# EAGLE design tian_light_mega_revc (EAGLE 6.1)
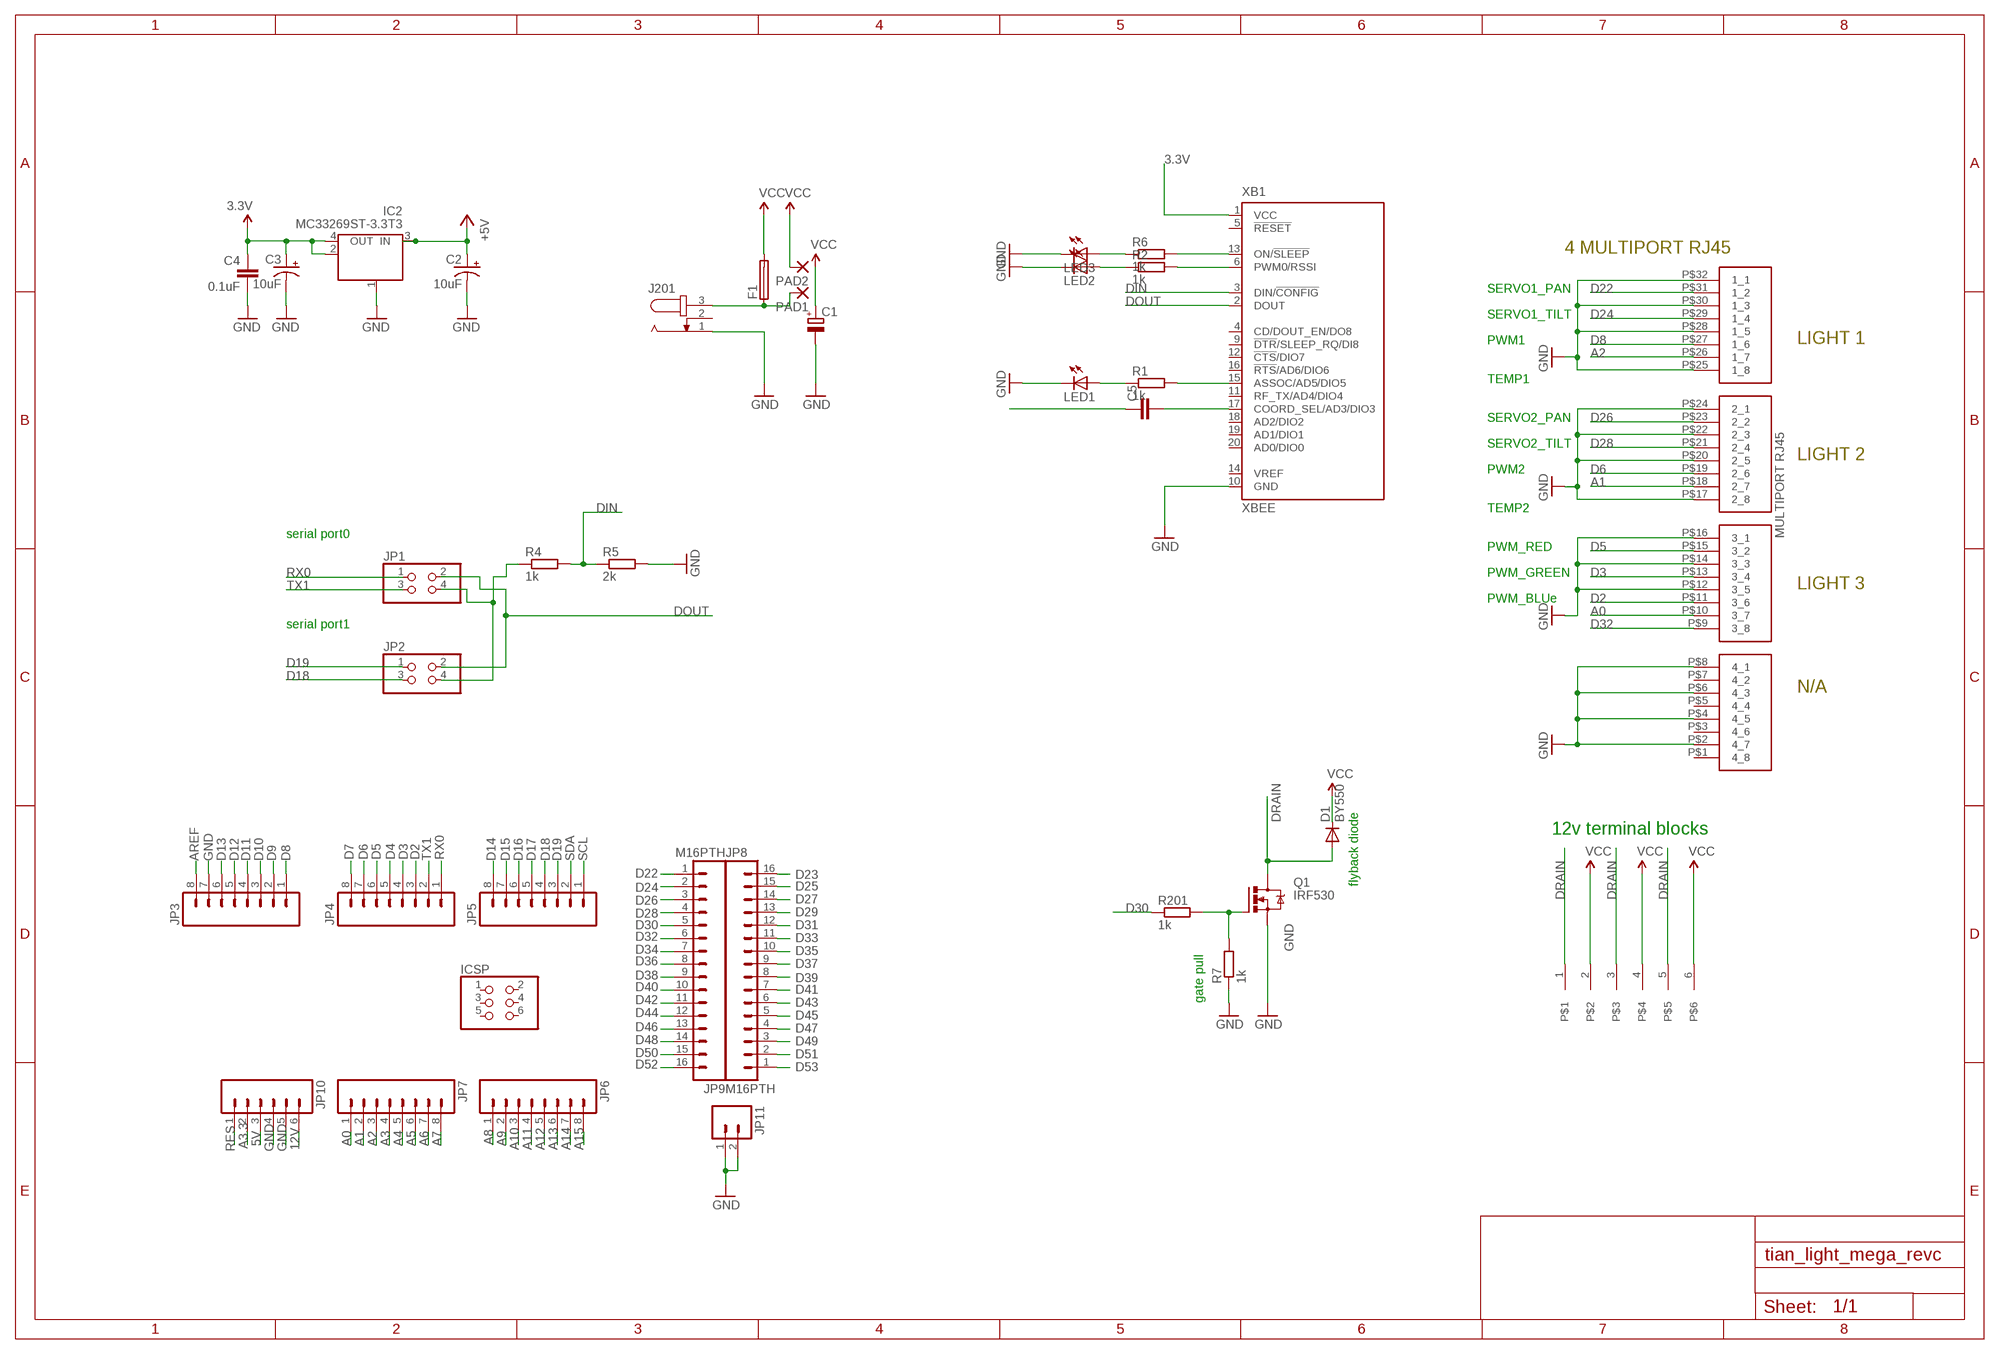
[diagram p0: schematic, sheet 1]

## Parts
C1  CPOL-EU153CLV-0605  [153CLV-0605]
C2  10uF  CAP_POL1206  [EIA3216]
C3  10uF  CAP_POL1206  [EIA3216]
C4  0.1uF  CAP0603-CAP  [0603-CAP]
C5  C-EUC0805  [C0805]
D1  BY550  [DO27-15]
F1  SH22,5  [SH22,5]
IC2  MC33269ST-3.3T3  [SOT223]
ICSP  PINHD-2X3  [2X03]
J201  JACK-PLUG0  [SPC4077]
JP1  PINHD-2X2  [2X02]
JP2  PINHD-2X2  [2X02]
JP3  M08LONGPADS  [1X08_LONGPADS]
JP4  M08LONGPADS  [1X08_LONGPADS]
JP5  M08LONGPADS  [1X08_LONGPADS]
JP6  M08LONGPADS  [1X08_LONGPADS]
JP7  M08LONGPADS  [1X08_LONGPADS]
JP8  M16PTH  [1X16]
JP9  M16PTH  [1X16]
JP10  M06SIP  [1X06]
JP11  M02LOCK  [1X02_LOCK]
LED1  LEDSML1206  [SML1206]
LED2  LEDSML1206  [SML1206]
LED3  LEDSML1206  [SML1206]
PAD1  2,15/1,0  [2,15/1,0]
PAD2  2,15/1,0  [2,15/1,0]
PORT201  4PORT_ETHERNET  [4PORT_ETHERNET]
Q1  IRF530  [TO220BV]
R1  1k  R-EU_M1206  [M1206]
R2  1k  R-EU_M1206  [M1206]
R4  1k  R-EU_M1206  [M1206]
R5  2k  R-EU_M1206  [M1206]
R6  1k  R-EU_M1206  [M1206]
R7  1k  R-EU_M1206  [M1206]
R201  1k  R-EU_M1206  [M1206]
U$3  MFKDSP6-5.08  [PHONEIX]
XB1  XBEE  [XBEE]

## Nets
3.3V: C3.A(+) C4.1 IC2.2(OUT) IC2.4(OUT) XB1.1(VCC)
5V: C2.A(+) IC2.3(IN) JP10.3 ; supply symbol labelled +5V
12V: C1.+ F1.2 JP10.6 PAD2.1(P) U$3.2 U$3.4 U$3.6 ; supply symbol labelled VCC
A0: JP7.1 PORT201.P$10(3_7)
A1: JP7.2 PORT201.P$18(2_7)
A2: JP7.3 PORT201.P$26(1_7)
A3: JP7.4
A3.3: JP10.2
A4: JP7.5
A5: JP7.6
A6: JP7.7
A7: JP7.8
A8: JP6.1
A9: JP6.2
A10: JP6.3
A11: JP6.4
A12: JP6.5
A13: JP6.6
A14: JP6.7
A15: JP6.8
AREF: JP3.8
D2: JP4.3 PORT201.P$11(3_6)
D3: JP4.4 PORT201.P$13(3_4)
D4: JP4.5
D5: JP4.6 PORT201.P$15(3_2)
D6: JP4.7 PORT201.P$19(2_6)
D7: JP4.8
D8: JP3.1 PORT201.P$27(1_6)
D9: JP3.2
D10: JP3.3
D11: JP3.4
D12: JP3.5
D13: JP3.6
D14: JP5.8
D15: JP5.7
D16: JP5.6
D17: JP5.5
D18: JP2.3 JP5.4
D19: JP2.1 JP5.3
D22: JP9.1 PORT201.P$31(1_2)
D23: JP8.16
D24: JP9.2 PORT201.P$29(1_4)
D25: JP8.15
D26: JP9.3 PORT201.P$23(2_2)
D27: JP8.14
D28: JP9.4 PORT201.P$21(2_4)
D29: JP8.13
D30: JP9.5 R201.1
D31: JP8.12
D32: JP9.6 PORT201.P$9(3_8)
D33: JP8.11
D34: JP9.7
D35: JP8.10
D36: JP9.8
D37: JP8.9
D38: JP9.9
D39: JP8.8
D40: JP9.10
D41: JP8.7
D42: JP9.11
D43: JP8.6
D44: JP9.12
D45: JP8.5
D46: JP9.13
D47: JP8.4
D48: JP9.14
D49: JP8.3
D50: JP9.15
D51: JP8.2
D52: JP9.16
D53: JP8.1
DIN: R4.2 R5.1 XB1.3(DIN/!CONFIG)
DOUT: JP1.2 JP2.2 XB1.2(DOUT)
DRAIN: D1.A Q1.D U$3.1 U$3.3 U$3.5
GND: C1.- C2.C(-) C3.C(-) C4.2 IC2.1(GND/ADJ) J201.1 JP3.7 JP10.4 JP10.5 JP11.1 JP11.2 LED1.C LED2.C LED3.C PORT201.P$2(4_7) PORT201.P$4(4_5) PORT201.P$6(4_3) PORT201.P$8(4_1) PORT201.P$12(3_5) PORT201.P$14(3_3) PORT201.P$16(3_1) PORT201.P$17(2_8) PORT201.P$20(2_5) PORT201.P$22(2_3) PORT201.P$24(2_1) PORT201.P$25(1_8) PORT201.P$28(1_5) PORT201.P$30(1_3) PORT201.P$32(1_1) Q1.S R5.2 R7.1 XB1.10(GND)
N$1: JP1.4 JP2.4 R4.1
N$2: LED1.A R1.1
N$3: Q1.G R7.2 R201.2
N$4: R1.2 XB1.15(ASSOC/AD5/DIO5)
N$5: R6.2 XB1.13(ON/!SLEEP)
N$6: LED2.A R2.1
N$7: R2.2 XB1.6(PWM0/RSSI)
N$8: LED3.A R6.1
N$9: C5.2 XB1.17(COORD_SEL/AD3/DIO3)
N$10: F1.1 J201.3 PAD1.1(P)
RES: C5.1 JP10.1
RX0: JP1.1 JP4.1
SCL: JP5.1
SDA: JP5.2
TX1: JP1.3 JP4.2
VCC: D1.C
Unconnected: ICSP.1 ICSP.2 ICSP.3 ICSP.4 ICSP.5 ICSP.6 J201.2 PORT201.P$1(4_8) PORT201.P$3(4_6) PORT201.P$5(4_4) PORT201.P$7(4_2) XB1.4(CD/DOUT_EN/DO8) XB1.5(!RESET) XB1.9(!DTR!/SLEEP_RQ/DI8) XB1.11(RF_TX/AD4/DIO4) XB1.12(!CTS!/DIO7) XB1.14(VREF) XB1.16(!RTS!/AD6/DIO6) XB1.18(AD2/DIO2) XB1.19(AD1/DIO1) XB1.20(AD0/DIO0)

## Notes on the sheet
- 4 MULTIPORT RJ45
- SERVO1_PAN
- SERVO1_TILT
- PWM1 | LIGHT 1
- TEMP1
- SERVO2_PAN
- SERVO2_TILT
- LIGHT 2
- PWM2
- TEMP2
- serial port0
- PWM_RED
- PWM_GREEN
- LIGHT 3
- PWM_BLUe
- serial port1
- N/A
- 12v terminal blocks
- flyback diode
- gate pull

## Library data of the parts
C1 = rcl:CPOL-EU: POLARIZED CAPACITOR, European symbol
C2 C3 = SparkFun:CAP_POL: Capacitor Polarized These are standard SMD and PTH capacitors. Normally 10uF, 47uF, and 100uF in electrolytic and tantalum varieties. Always verify the external diameter of the through hole cap, it varies with capacity, voltage, and manufacturer. The EIA devices should be standard.
C4 = SparkFun:CAP: Capacitor Standard 0603 ceramic capacitor, and 0.1" leaded capacitor.
C5 = rcl:C-EU: CAPACITOR, European symbol
D1 = diode:BY550: DIODE Si200 V, 5 A
F1 = fuse:SH22,5: FUSE HOLDER grid 22,5 mm, OGN0031 8201, Schurter (Buerklin); MF: SCHURTER; MPN: 0031.8201; OC_FARNELL: 1162740; OC_NEWARK: 96F8317
IC2 = linear:MC33269ST*: Adjustable Output Low Dropout Voltage Regulator 800 mA Source: http://www.onsemi.com/pub/Collateral/MC33269-D.PDF
ICSP = pinhead:PINHD-2X3: PIN HEADER
J201 = con-jack:JACK-PLUG: DC POWER JACK Power Jack, DC, Right Angle, Through Hole, Rated 5A at 16VDC, PC Terminals Distributor: Farnell (www.Farnell.de) Drawing: 84N1161.pdf / 84N1162.pdf Manufacturer: SPC Technology (www.spctechnology.com) Type: SPC4077 / SPC 4078; OC_FARNELL: unknown; OC_NEWARK: unknown
JP1 JP2 = pinhead:PINHD-2X2: PIN HEADER
JP3-JP7 = SparkFun:M08: Header 8 Standard 8-pin 0.1" header. Use with straight break away headers (SKU : PRT-00116), right angle break away headers (PRT-00553), swiss pins (PRT-00743), machine pins (PRT-00117), and female headers (PRT-00115).
JP8 JP9 = SparkFun:M16
JP10 = SparkFun:M06: Header 6 Standard 6-pin 0.1" header. Use with straight break away headers (SKU : PRT-00116), right angle break away headers (PRT-00553), swiss pins (PRT-00743), machine pins (PRT-00117), and female headers (PRT-00115). Molex polarized connector foot print use with SKU : PRT-08094 with associated crimp pins and housings. NOTES ON THE VARIANTS LOCK and LOCK_LONGPADS... This footprint was designed to help hold the alignment of a through-hole component (i.e. 6-pin header) while soldering it into place. You may notice that each hole has been shifted either up or down by 0.005 of an inch from it's more standard position (which is a perfectly straight line). This slight alteration caused the pins (the squares in the middle) to touch the edges of the holes. Because they are alternating, it causes a "brace" to hold the component in place. 0.005 has proven to be the perfect amount of "off-center" position when using our standard breakaway headers. Although looks a little odd when you look at the bare footprint, once you have a header in there, the alteration is very hard to notice. Also, if you push a header all the way into place, it is covered up entirely on the bottom side. This idea of altering the position of holes to aid alignment will be further integrated into the Sparkfun Library for other footprints. It can help hold any component with 3 or more connection pins.
JP11 = SparkFun:M02: Header 2 Standard 2-pin 0.1" header. Use with straight break away headers (SKU : PRT-00116), right angle break away headers (PRT-00553), swiss pins (PRT-00743), machine pins (PRT-00117), and female headers (PRT-00115). Molex polarized connector foot print use with SKU : PRT-08233 with associated crimp pins and housings.
LED1-LED3 = led:LED: LED OSRAM: - CHIPLED LG R971, LG N971, LY N971, LG Q971, LY Q971, LO R971, LY R971 LH N974, LH R974 LS Q976, LO Q976, LY Q976 LO Q996 - Hyper CHIPLED LW Q18S LB Q993, LB Q99A, LB R99A - SideLED LS A670, LO A670, LY A670, LG A670, LP A670 LB A673, LV A673, LT A673, LW A673 LH A674 LY A675 LS A676, LA A676, LO A676, LY A676, LW A676 LS A679, LY A679, LG A679 - Hyper Micro SIDELED® LS Y876, LA Y876, LO Y876, LY Y876 LT Y87S - SmartLED LW L88C, LW L88S LB L89C, LB L89S, LG L890 LS L89K, LO L89K, LY L89K LS L896, LA L896, LO L896, LY L896 - TOPLED LS T670, LO T670, LY T670, LG T670, LP T670 LSG T670, LSP T670, LSY T670, LOP T670, LYG T670 LG T671, LOG T671, LSG T671 LB T673, LV T673, LT T673, LW T673 LH T674 LS T676, LA T676, LO T676, LY T676, LB T676, LH T676, LSB T676, LW T676 LB T67C, LV T67C, LT T67C, LS T67K, LO T67K, LY T67K, LW E67C LS E67B, LA E67B, LO E67B, LY E67B, LB E67C, LV E67C, LT E67C LW T67C LS T679, LY T679, LG T679 LS T770, LO T770, LY T770, LG T770, LP T770 LB T773, LV T773, LT T773, LW T773 LH T774 LS E675, LA E675, LY E675, LS T675 LS T776, LA T776, LO T776, LY T776, LB T776 LHGB T686 LT T68C, LB T68C - Hyper Mini TOPLED® LB M676 - Mini TOPLED Santana® LG M470 LS M47K, LO M47K, LY M47K Source: http://www.osram.convergy.de LUXEON: - LUMILED® LXK2-PW12-R00, LXK2-PW12-S00, LXK2-PW14-U00, LXK2-PW14-V00 LXK2-PM12-R00, LXK2-PM12-S00, LXK2-PM14-U00 LXK2-PE12-Q00, LXK2-PE12-R00, LXK2-PE12-S00, LXK2-PE14-T00, LXK2-PE14-U00 LXK2-PB12-K00, LXK2-PB12-L00, LXK2-PB12-M00, LXK2-PB14-N00, LXK2-PB14-P00, LXK2-PB14-Q00 LXK2-PR12-L00, LXK2-PR12-M00, LXK2-PR14-Q00, LXK2-PR14-R00 LXK2-PD12-Q00, LXK2-PD12-R00, LXK2-PD12-S00 LXK2-PH12-R00, LXK2-PH12-S00 LXK2-PL12-P00, LXK2-PL12-Q00, LXK2-PL12-R00 Source: www.luxeon.com KINGBRIGHT: KA-3528ASYC Source: www.kingbright.com
PAD1 PAD2 = wirepad:2,15/1,0: THROUGH-HOLE PAD
PORT201 = strukt:4PORT_ETHERNET
Q1 = transistor-power:IRF530: HEXFET Power MOSFET
R1 R2 R4-R7 R201 = rcl:R-EU_: RESISTOR, European symbol
U$3 = con-phoenix-MFKDSP:MFKDSP6-5.08
XB1 = maxstream:XBEE: XBee (TM) /XBee-PRO(TM) OEM RF Modules Source: MaxStream, Inc. xbee_productmanual.pdf; MPN: XBP24-Z7UIT-004; OC_FARNELL: 1751799; OC_NEWARK: 34R5507

## Net classes
0 default: width 0.203 mm, drill 0.559 mm, clearance 0.203 mm

## Board
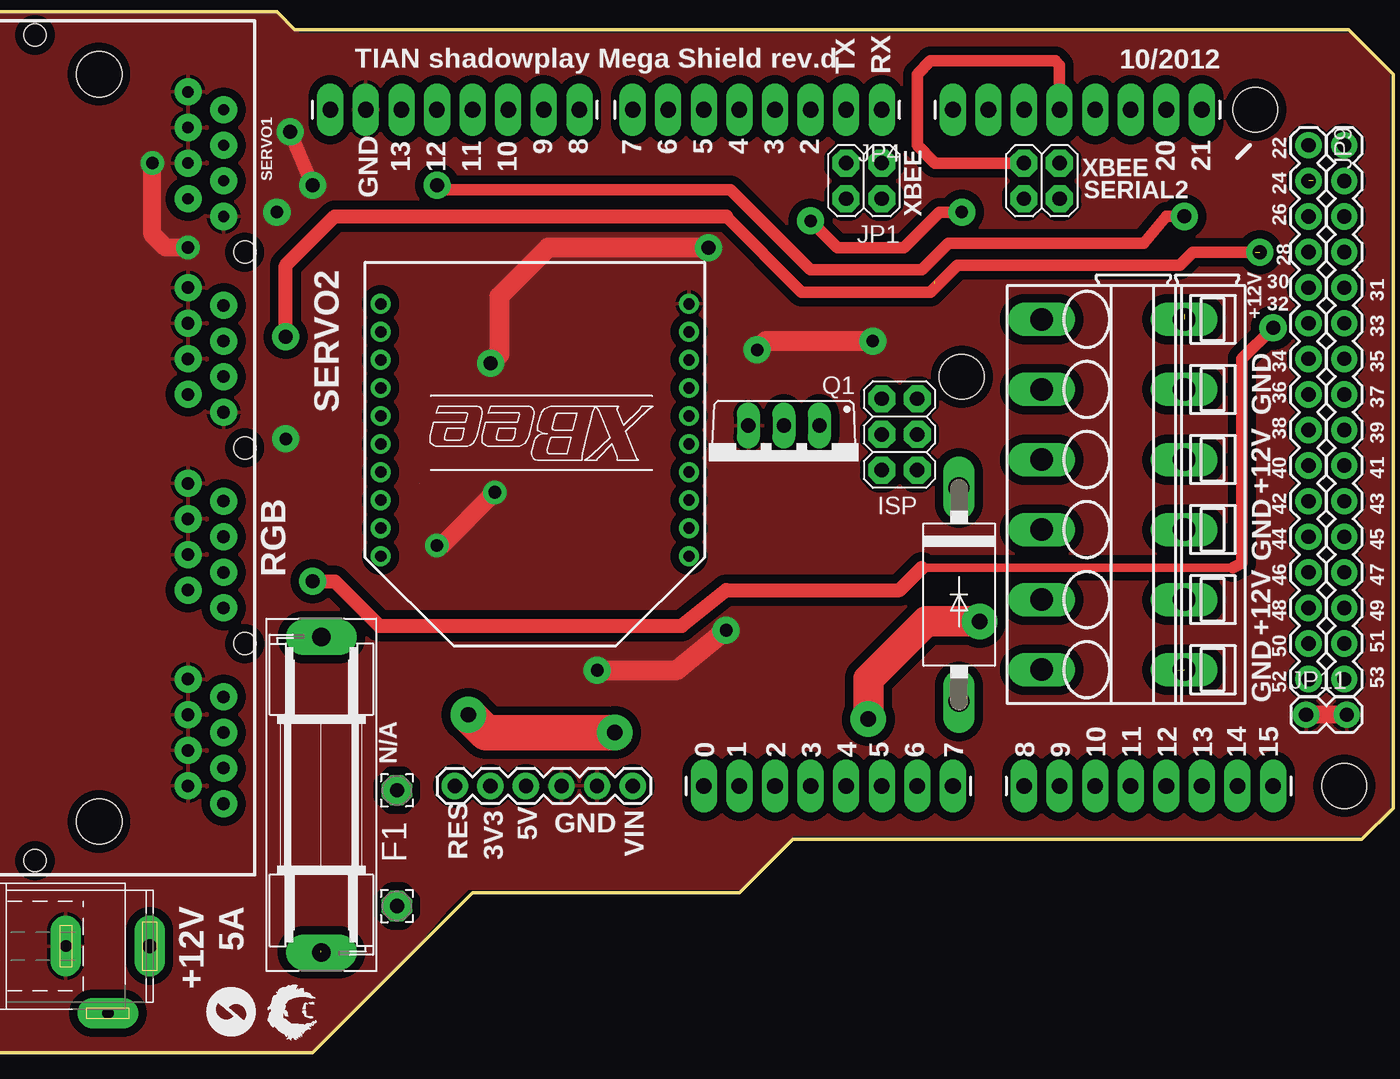
[diagram p1: board, top side]
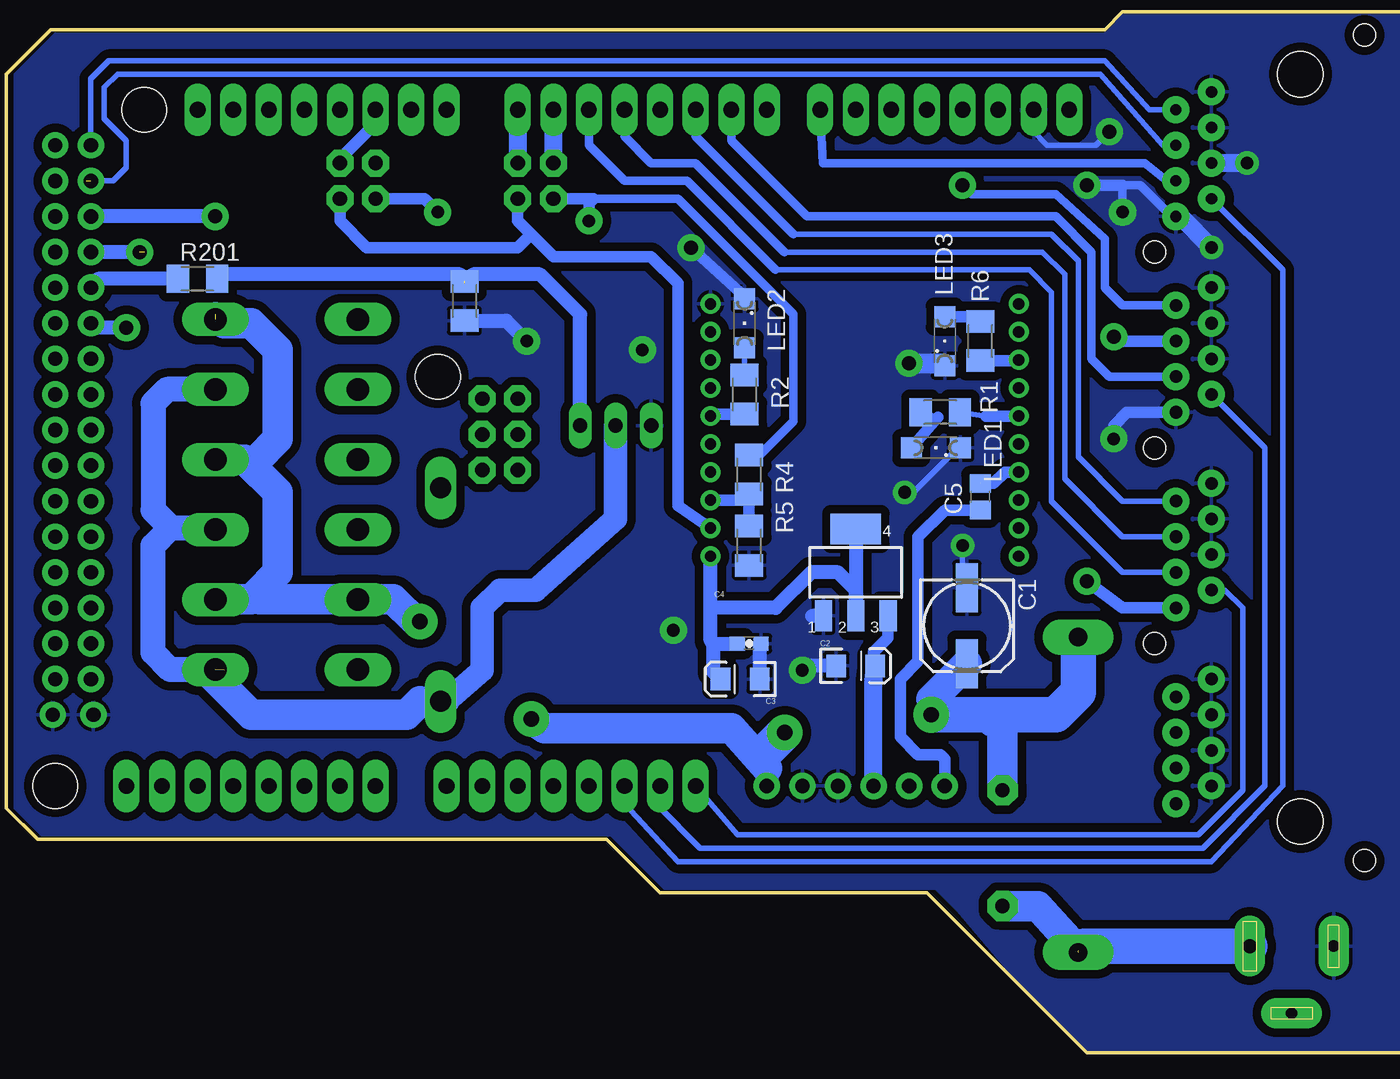
[diagram p2: board, bottom side, seen from below]

No outline drawn. Coordinates in mm, seen from the top.
Copper layers (1*16): Top 0.035mm / dielectric 1.5mm / Bottom 0.035mm
Design rules: minimum track width 8mil, minimum drill 20mil, track to track 8mil, track to pad 8mil, pad to pad 8mil, via to via 8mil, smd to smd 8mil, copper to edge 10mil, drill to drill 8mil, minimum pad ring 12mil, minimum via ring 10mil, stop-mask expansion 4mil, vias tented up to drill 25mil, thermal gap 10mil
Holes 3.2 mm at 79.38,51.44 85.72,3.17 58.42,32.38
Milling: 14 lines

### Footprints (pad centres in the part's own frame; a part is rotated, then mirrored left to right if it is on the bottom)
153CLV-0605 = smd 3.5 x 1.6: + 2.7,0; - -2.7,0
EIA3216 = smd 1.4 x 1.6: A 1.4,0; C -1.4,0
0603-CAP = smd 1.1 x 1: 1 -0.85,0; 2 0.85,0
C0805 = smd 1.3 x 1.5: 1 -0.95,0; 2 0.95,0
DO27-15 = drill 1.499 long: A 7.62,0; C -7.62,0
SH22,5 = drill 1.321 pad 2.54 long: 1 -11.252,0; 2 11.252,0
SOT223 = smd 1.219 x 2.235: 1 -2.311,-3.099; 2 0,-3.099; 3 2.311,-3.099 | smd 3.6 x 2.2: 4 0,3.099
2X03 = drill 1.016 pad 1.93 octagon: 1 -2.54,-1.27; 2 -2.54,1.27; 3 0,-1.27; 4 0,1.27; 5 2.54,-1.27; 6 2.54,1.27
SPC4077 = drill 0.8 pad 2.184 long: 1 -3,0; 2 0,-4.8 | drill 1 pad 2.184 long: 3 3,0
2X02 = drill 1.016 pad 1.93 octagon: 1 -1.27,-1.27; 2 -1.27,1.27; 3 1.27,-1.27; 4 1.27,1.27
1X08_LONGPADS = drill 1.118 pad 1.88 long: 1 0,0; 2 2.54,0; 3 5.08,0; 4 7.62,0; 5 10.16,0; 6 12.7,0; 7 15.24,0; 8 17.78,0
1X16 = drill 1.016 pad 1.88: 1 0,0; 2 2.54,0; 3 5.08,0; 4 7.62,0; 5 10.16,0; 6 12.7,0; 7 15.24,0; 8 17.78,0; 9 20.32,0; 10 22.86,0; 11 25.4,0; 12 27.94,0; 13 30.48,0; 14 33.02,0; 15 35.56,0; 16 38.1,0
1X06 = drill 1.016 pad 1.88: 1 0,0; 2 2.54,0; 3 5.08,0; 4 7.62,0; 5 10.16,0; 6 12.7,0
1X02_LOCK = drill 1.016 pad 1.88: 1 -0.178,0; 2 2.718,0
SML1206 = smd 1.5 x 1.5: A 1.75,0; C -1.75,0
2,15/1,0 = drill 1.016 pad 2.159 octagon: 1 0,0
4PORT_ETHERNET = drill 0.9 pad 1.93: P$1 25.4,8.89; P$2 24.13,6.35; P$3 22.86,8.89; P$4 21.59,6.35; P$5 20.32,8.89; P$6 19.05,6.35; P$7 17.78,8.89; P$8 16.51,6.35; P$9 11.43,8.89; P$10 10.16,6.35; P$11 8.89,8.89; P$12 7.62,6.35; P$13 6.35,8.89; P$14 5.08,6.35; P$15 3.81,8.89; P$16 2.54,6.35; P$17 -2.54,8.89; P$18 -3.81,6.35; P$19 -5.08,8.89; P$20 -6.35,6.35; P$21 -7.62,8.89; P$22 -8.89,6.35; P$23 -10.16,8.89; P$24 -11.43,6.35 | drill 0.8 pad 1.93: P$25 -16.51,8.89; P$26 -17.78,6.35; P$27 -19.05,8.89; P$28 -20.32,6.35; P$29 -21.59,8.89; P$30 -22.86,6.35; P$31 -24.13,8.89; P$32 -25.4,6.35 | hole 3.25: -26.67,0; 26.67,0 | hole 1.57: -13.97,10.41; 0,10.41; 13.97,10.41; -29.46,-4.57; 29.46,-4.57
TO220BV = drill 1.016 long: D 0,-2.54; G -2.54,-2.54; S 2.54,-2.54
M1206 = smd 1.6 x 2: 1 -1.4,0; 2 1.4,0
PHONEIX = drill 1.6 pad 1.8 long: 1 2.58,4.445; 2 7.58,4.445; 3 12.58,4.445; 4 17.58,4.445; 5 22.58,4.445; 6 27.58,4.445; 7 2.58,14.605; 8 7.58,14.605; 9 12.58,14.605; 10 17.58,14.605; 11 22.58,14.605; 12 27.58,14.605
XBEE = drill 0.8 pad 1.422: 1 -11,9; 2 -11,7; 3 -11,5; 4 -11,3; 5 -11,1; 6 -11,-1; 7 -11,-3; 8 -11,-5; 9 -11,-7; 10 -11,-9; 11 11,-9; 12 11,-7; 13 11,-5; 14 11,-3; 15 11,-1; 16 11,1; 17 11,3; 18 11,5; 19 11,7; 20 11,9

### Placement (x,y rotation side)
C1  20.64,14.61 270 bottom
C2  28.57,11.75 0 bottom
C3  36.83,10.79 180 bottom
C4  36.2,13.34 0 bottom
C5  19.68,23.81 90 bottom
D1  58.23,16.83 270 top
F1  12.7,2.54 90 top
IC2  28.57,18.41 0 bottom
ICSP  53.98,28.26 270 top
J201  -2.54,-8.26 0 top
JP1  51.44,46.35 180 top
JP2  64.14,46.35 180 top
JP3  31.11,51.44 180 top
JP4  52.7,51.44 180 top
JP5  57.78,51.44 0 top
JP6  62.87,3.17 0 top
JP7  40.01,3.17 0 top
JP8  85.72,48.9 270 top
JP9  83.19,48.9 270 top
JP10  22.23,3.17 0 top
JP11  83.19,8.26 0 top
LED1  22.86,27.3 180 bottom
LED2  36.51,36.2 270 bottom
LED3  22.23,34.92 90 bottom
PAD1  18.1,-5.4 0 top
PAD2  18.1,2.86 0 top
PORT201  -3.17,27.3 270 top
Q1  45.72,26.35 180 top
R1  22.54,29.84 0 bottom
R2  36.51,31.11 270 bottom
R4  36.2,25.4 270 bottom
R5  36.2,20.32 270 bottom
R6  19.68,34.92 270 bottom
R7  56.52,37.78 90 bottom
R201  75.56,39.37 0 bottom
U$3  78.74,8.89 90 top
XB1  27.94,28.57 180 top

### Tracks (layer width: path | path; a pad name or v marks a point on that pad's centre or on a via)
3.3V
  Bottom 1.016: C3.A 38.73,11.3 38.73,13.34 | 38.73,13.34 38.94,13.54 38.94,15.88 | 38.94,15.88 XB1.1 | 38.73,13.34 C4.1 | IC2.4 IC2.2 | IC2.2 28.57,15.24 | IC2.2 28.57,17.14 29.84,18.41 31.75,18.41 34.29,15.88 38.94,15.88
5V
  Bottom 0.406: C2.A 27.18,11.62
  Bottom 0.813: IC2.3 26.26,13.74 27.3,12.7 27.3,10.93 C2.A
  Bottom 1.27: JP10.3 27.3,10.66 C2.A
12V  (via drill 1.1 pad 2.54)  (1 unrouted)
  Top 2.184: v51.75,7.94 51.75,10.79 55.88,14.92 v59.69,14.92
  Top 2.54: v33.66,6.99 24.45,6.99 v23.18,8.26
  Bottom 1.016: U$3.4 71.32,26.47 | 74.25,16.51 U$3.2 74.3,16.51
  Bottom 1.676: 34.92,5.71 JP10.6 34.92,4.45 | v23.18,8.26 23.18,9.37 | v59.69,14.92 60.01,14.92 | 71.12,16.51 71.44,16.83
  Bottom 1.778: 73.66,36.2 74.3,36.83 | 71.44,16.83 71.75,16.51
  Bottom 2.184: 71.32,26.47 69.85,27.94 69.85,34.29 71.75,36.2 73.66,36.2 | U$3.4 72.19,26.47 69.85,24.13 69.85,18.41 71.44,16.83 | 71.75,16.51 74.25,16.51 | 23.18,9.37 C1.+ | 34.92,4.45 37.47,7.3 50.8,7.3 v51.75,7.94 | 60.01,14.92 61.59,16.51 71.12,16.51 | PAD2.1 18.1,7.3 18.73,7.94
  Bottom 2.54: 34.92,5.71 v33.66,6.99 | F1.2 12.7,9.84 14.29,8.26 19.05,8.26 | 19.05,8.26 v23.18,8.26 | 18.73,7.94 19.05,8.26
A0
  Bottom 0.406: PORT201.P$10 2.22,17.14 0.95,15.88 0.95,2.86 4.13,-0.32 37.02,-0.32 JP7.1
A1
  Bottom 0.406: JP7.2 42.74,1.78 39.69,-1.27 3.81,-1.27 -0.64,3.17 -0.64,27.3 PORT201.P$18
A2
  Bottom 0.406: JP7.3 45.09,1.91 41.27,-2.22 3.17,-2.22 -1.91,3.17 -1.91,40.01 PORT201.P$26
D2
  Bottom 0.406: PORT201.P$11 9.53,18.41 14.61,23.5 14.61,38.42 16.19,40.01 34.29,40.01
  Bottom 0.61: 34.29,40.01 40.64,46.35 45.09,46.35 47.62,48.9 JP4.3
D3
  Bottom 0.406: PORT201.P$13 9.53,20.95 13.65,25.08 13.65,39.69 15.24,41.27 33.66,41.27
  Bottom 0.61: 33.66,41.27 40.01,47.62 43.18,47.62 45.09,49.53 JP4.4
D5
  Bottom 0.406: PORT201.P$15 9.53,23.5 12.7,26.67 12.7,40.64 14.61,42.55 33.02,42.55
  Bottom 0.61: 33.02,42.55 40.01,49.53 JP4.6
D6
  Bottom 0.61: PORT201.P$19 10.48,32.38 11.75,33.66 11.75,41.27 14.29,43.81 32.07,43.81 37.47,49.21 JP4.7
D8
  Bottom 0.406: PORT201.P$27 6.35,46.35
  Bottom 0.61: 6.35,46.35 7.94,47.62 30.92,47.62 JP3.1
D18
  Top 0.813: JP2.3 56.52,47.62 55.24,48.9 55.24,53.98 56.2,54.93 65.09,54.93 65.41,54.61 JP5.4
D19
  Bottom 0.813: JP2.1 65.41,47.94 62.87,50.48 JP5.3
D22
  Bottom 0.406: PORT201.P$31 7.62,51.44 10.79,54.93 81.92,54.93 83.19,53.66 JP9.1
D24  (1 unrouted)
  Bottom 0.406: PORT201.P$29 6.67,48.9 11.11,53.98 81.28,53.98 82.23,53.02 82.23,50.8 80.64,49.21 80.64,47.31 81.6,46.35 83.5,46.35 | 82.74,46.67 JP9.2
D26  (via drill 1 pad 1.93)
  Top 0.406: 21.27,45.72 v20.95,46.04
  Top 0.813: v74.3,43.81 73.03,43.81 71.44,41.91 57.47,41.91 55.56,40.01 47.62,40.01 41.91,45.72 21.27,45.72
  Bottom 0.61: PORT201.P$23 9.53,37.47 10.79,38.73 10.79,42.23 14.29,45.4 20.32,45.4 v20.95,46.04
  Bottom 1.016: v74.3,43.81 JP9.3
D28  (via drill 1 pad 1.93)  (1 unrouted)
  Top 0.813: 41.59,43.81 46.99,38.42 56.2,38.42 58.1,40.32 73.98,40.32 74.93,41.27 79.38,41.27 79.69,41.59
  Top 1.016: 41.59,43.81 13.65,43.81 10.16,40.32 v10.16,35.24
  Bottom 0.813: PORT201.P$21 9.84,34.92 v10.16,35.24
  Bottom 1.016: v79.69,41.27 JP9.4
D30
  Bottom 0.406: 82.68,39.37 JP9.5
  Bottom 1.016: R201.1 82.68,39.37
D32  (via drill 1 pad 1.93)
  Top 0.61: 55.56,18.73 77.79,18.73
  Top 0.813: 77.79,18.73 78.42,19.05 78.42,33.66 v80.64,35.88
  Top 1.016: v12.06,17.78 13.65,17.78 16.83,14.61 38.42,14.61 41.59,17.14 53.98,17.14 55.56,18.73
  Bottom 0.813: PORT201.P$9 9.53,15.88 v12.06,17.78
  Bottom 1.016: v80.64,35.88 82.74,35.88 JP9.6
DIN
  Bottom 0.406: 36.62,23.57 R4.2
  Bottom 0.813: R4.2 R5.1 | XB1.3 36.62,23.57
DOUT
  Bottom 0.813: XB1.2 41.26,23.16 41.27,24.45 41.27,39.05 43.18,40.96 50.16,40.96 51.75,42.55 | 51.75,42.55 52.7,43.5 JP1.2 | JP2.2 65.41,43.5 63.5,41.59 52.7,41.59 51.75,42.55
DRAIN  (1 unrouted)
  Bottom 1.27: D1.A 59.69,9.21 | 71.75,8.26 72.07,8.57
  Bottom 1.422: 73.66,11.43 74.93,11.43
  Bottom 1.676: 74.42,21.59 U$3.3 | 57.78,9.21 55.24,11.43 55.24,15.88 53.98,17.14 51.44,17.14 45.72,22.23 Q1.D
  Bottom 1.778: U$3.1 77.51,11.47 78.74,12.7 78.74,20.32 77.47,21.59 | 77.47,21.59 74.42,21.59 | U$3.5 77.75,31.47 78.74,30.48 78.74,22.86 77.47,21.59 | 57.78,9.21 D1.A
  Bottom 2.184: 72.07,8.57 74.93,11.43 | 59.69,9.21 60.64,8.26 71.75,8.26
GND  (via drill 0.9 pad 1.68, 0.9 pad 1.93, 1 pad 1.93)
  Top 0.406: v20.95,20.32 21.27,20.32
  Top 1.016: v12.06,46.04 v10.48,49.85
  Top 1.27: JP11.2 JP11.1 | 21.27,20.32 v25.08,24.13 | v3.17,41.59 1.59,41.59 0.64,42.55 v0.64,47.62
  Top 1.422: v40.32,41.59 28.89,41.59 25.4,38.1 25.4,33.97 v24.77,33.34 | v32.38,11.43 38.1,11.43 v41.59,14.29 | v52.07,34.92 44.45,34.92 v43.81,34.29
  Bottom 0.406: LED2.C 36.83,38.42 | 22.39,33.34 LED3.C | 6.03,43.81 PORT201.P$25 5.4,43.81 | JP3.7 15.88,49.85 14.92,48.9 11.43,48.9 v10.48,49.85 | C1.- 20.95,17.3 v20.95,20.32 | v25.08,24.13 24.45,24.13 21.27,27.3
  Bottom 0.61: 6.03,43.81 8.26,46.04 9.53,46.04 v9.53,44.13
  Bottom 0.813: 36.83,38.42 v40.32,41.59 | 9.53,46.04 v12.06,46.04 | PORT201.P$17 9.21,29.84 10.16,28.89 v10.16,27.94
  Bottom 1.016: C3.C 35.43,13.25 C4.2 | C2.C 32.07,11.75 v32.38,11.43 | R7.1 53.53,36.38 v52.07,34.92 | IC2.1 31.67,15.32
  Bottom 1.27: 5.4,43.81 v3.17,41.59 | v0.64,47.62 3.49,47.62
  Bottom 1.422: v24.77,33.34 22.39,33.34
  pour Bottom (isolate 0.61): -13.65,-15.88 -13.65,56.83 -12.06,58.42 9.21,58.42 10.79,56.83 85.72,56.83 88.58,53.98 88.58,1.59 86.68,-0.32 46.04,-0.32 42.23,-4.13 22.86,-4.13 21.27,-5.71 17.78,-9.84 11.75,-15.88
  pour Top (isolate 0.61): -13.34,-15.88 -13.34,56.83 -11.75,58.42 9.53,58.42 11.11,56.83 86.04,56.83 88.9,53.98 88.9,1.59 87,-0.32 46.35,-0.32 42.55,-4.13 23.18,-4.13 21.59,-5.71 18.1,-9.84 12.06,-15.88
N$1  (via drill 0.9 pad 1.93)
  Top 0.813: v58.42,44.13 56.83,44.13 54.29,41.59 49.53,41.59 v47.62,43.5
  Bottom 0.406: R4.1 35.43,26.8
  Bottom 0.61: 35.43,26.8 33.02,29.21 33.02,36.83 41.27,45.09 47.31,45.09 | 47.62,45.09 JP1.4
  Bottom 0.813: JP2.4 59.37,45.09 v58.42,44.13 | v47.62,43.5 47.62,44.77 47.31,45.09 47.62,45.09 50.48,45.09
N$2
  Bottom 0.406: 22.7,29.5 R1.1
  Bottom 0.813: LED1.A 22.7,29.5
N$3  (1 unrouted)
  Bottom 1.016: Q1.G 48.26,36.83 51.12,39.69 55.88,39.69 56.52,39.05 | R7.2 56.52,39.37 56.83,39.69 73.85,39.69 R201.2
N$4
  Bottom 0.406: 19.29,29.57 R1.2
  Bottom 0.813: XB1.15 19.29,29.57
N$5
  Bottom 0.406: 16.99,33.52 XB1.13
  Bottom 0.813: R6.2 16.99,33.52
N$6
  Bottom 0.406: R2.1 LED2.A
N$7
  Bottom 0.406: 38.8,29.71 XB1.6
  Bottom 0.813: R2.2 38.8,29.71
N$8
  Bottom 0.406: 20.04,36.67 R6.1
  Bottom 0.813: LED3.A 20.04,36.67
N$9  (1 unrouted)
  Bottom 0.813: XB1.17 17.92,25.57 18.73,24.77 C5.2
N$10  (1 unrouted)
  Bottom 2.184: PAD1.1 15.56,-5.4 12.7,-8.57
  Bottom 2.54: J201.3 12.24,-8.26 F1.1
RES
  Bottom 0.813: C5.1 22.22,22.86 24.13,20.95 24.13,12.06 25.4,10.79 25.4,6.67 24.13,5.4 22.54,5.4 22.23,5.08 JP10.1
RX0
  Bottom 1.27: JP4.1 JP1.1
TX1
  Bottom 1.27: JP1.3 JP4.2

### Text on the board
tPlace: TIAN shadowplay Mega Shield rev.d | 10/2012 | TX | RX | 9 | 8 | 7 | 6 | 5 | 4 | 3 | 2 | 22 | 13 | 12 | 11 | 10 | XBEE | 20 | 21 | SERVO1 | SERIAL2 | GND | 24 | XBEE | 26 | +12V | 30 | 28 | 32 | 31 | 33 | 34 | 35 | SERVO2 | GND | 36 | 37 | +12V | 38 | 39 | 40 | 41 | ISP | 42 | 43 | 44 | 45 | +12V | GND | RGB | 46 | 47 | 48 | 49 | 51 | 50 | 52 | 53 | GND | N/A | 0 | 1 | 2 | 3 | 4 | 5 | 6 | 7 | 8 | 9 | 10 | 11 | 12 | 13 | 14 | 15 | GND | 5V | RES | 3V3 | VIN | +12V | 5A